# EAGLE schematic BMS_High_Level_4_17_19 (EAGLE 9.3.1)

## Sheet 1 of 3: High Level
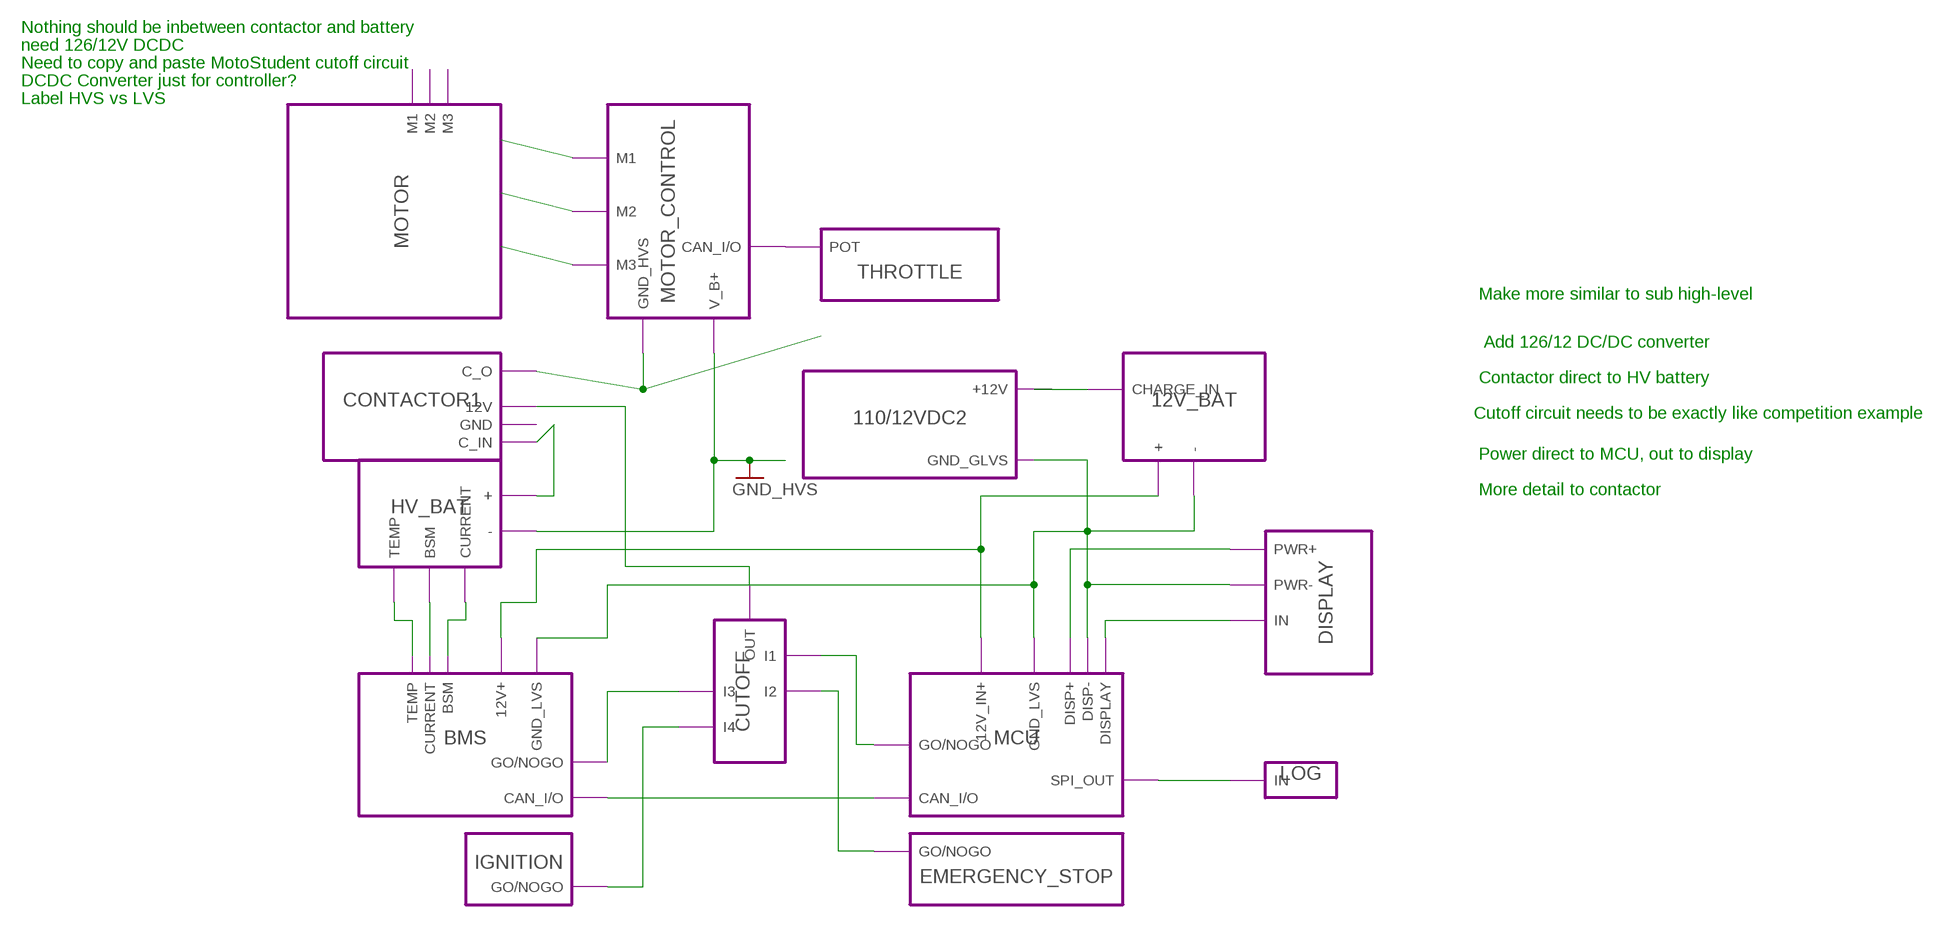
[diagram p0: schematic, sheet 1]

### Module instances
BMS = MODULE
CONTACTOR1 = CONTACTOR
MOTOR_CONTROL = MOTOR/MOTOR_CONTROL
CUTOFF = CUTOFF
MCU = MCU
EMERGENCY_STOP = EMERGENCY_STOP
THROTTLE = THROTTLE
IGNITION = IGNITION
DISPLAY = DISPLAY
LOG = LOG
MOTOR = MOTOR
HV_BAT = HV_BAT
12V_BAT = 12V_BAT
110/12VDC2 = 110/12VDC

### Nets
GND_BMS: port MOTOR_CONTROL.V_B+ 110/12VDC2.GND_GLVS HV_BAT.- ; supply symbol labelled GND_HVS
N$5: port 12V_BAT.CHARGE_IN
N$6: port CONTACTOR1.C_O 110/12VDC2.+12V MOTOR_CONTROL.GND_HVS
N$7: port MCU.DISPLAY DISPLAY.IN
N$8: port BMS.12V+ MCU.12V_IN+ 12V_BAT.+
N$9: port BMS.GND_LVS MCU.GND_LVS 12V_BAT.- MCU.DISP- DISPLAY.PWR-
N$10: port DISPLAY.PWR+ MCU.DISP+
N$11: port HV_BAT.+ CONTACTOR1.C_IN
N$13: port HV_BAT.BSM BMS.CURRENT
N$14: port HV_BAT.TEMP BMS.TEMP
N$15: port HV_BAT.CURRENT BMS.BSM
N$16: port IGNITION.GO/NOGO CUTOFF.I4
N$17: port BMS.GO/NOGO CUTOFF.I3
N$18: port BMS.CAN_I/O MCU.CAN_I/O
N$19: port MCU.GO/NOGO CUTOFF.I1
N$20: port EMERGENCY_STOP.GO/NOGO CUTOFF.I2
N$21: port MCU.SPI_OUT LOG.IN
N$22: port CONTACTOR1.12V CUTOFF.OUT
N$45: port THROTTLE.POT MOTOR_CONTROL.CAN_I/O
N$50: port MOTOR_CONTROL.M1 MOTOR.M1
N$51: port MOTOR_CONTROL.M2 MOTOR.M2
N$52: port MOTOR_CONTROL.M3 MOTOR.M3

### Notes on the sheet
- Nothing should be inbetween contactor and battery
- need 126/12V DCDC
- Need to copy and paste MotoStudent cutoff circuit
- DCDC Converter just for controller?
- Label HVS vs LVS
- Make more similar to sub high-level
- Add 126/12 DC/DC converter
- Contactor direct to HV battery
- Cutoff circuit needs to be exactly like competition example
- Power direct to MCU, out to display
- More detail to contactor

## Sheet 2 of 3: Sub-High Level
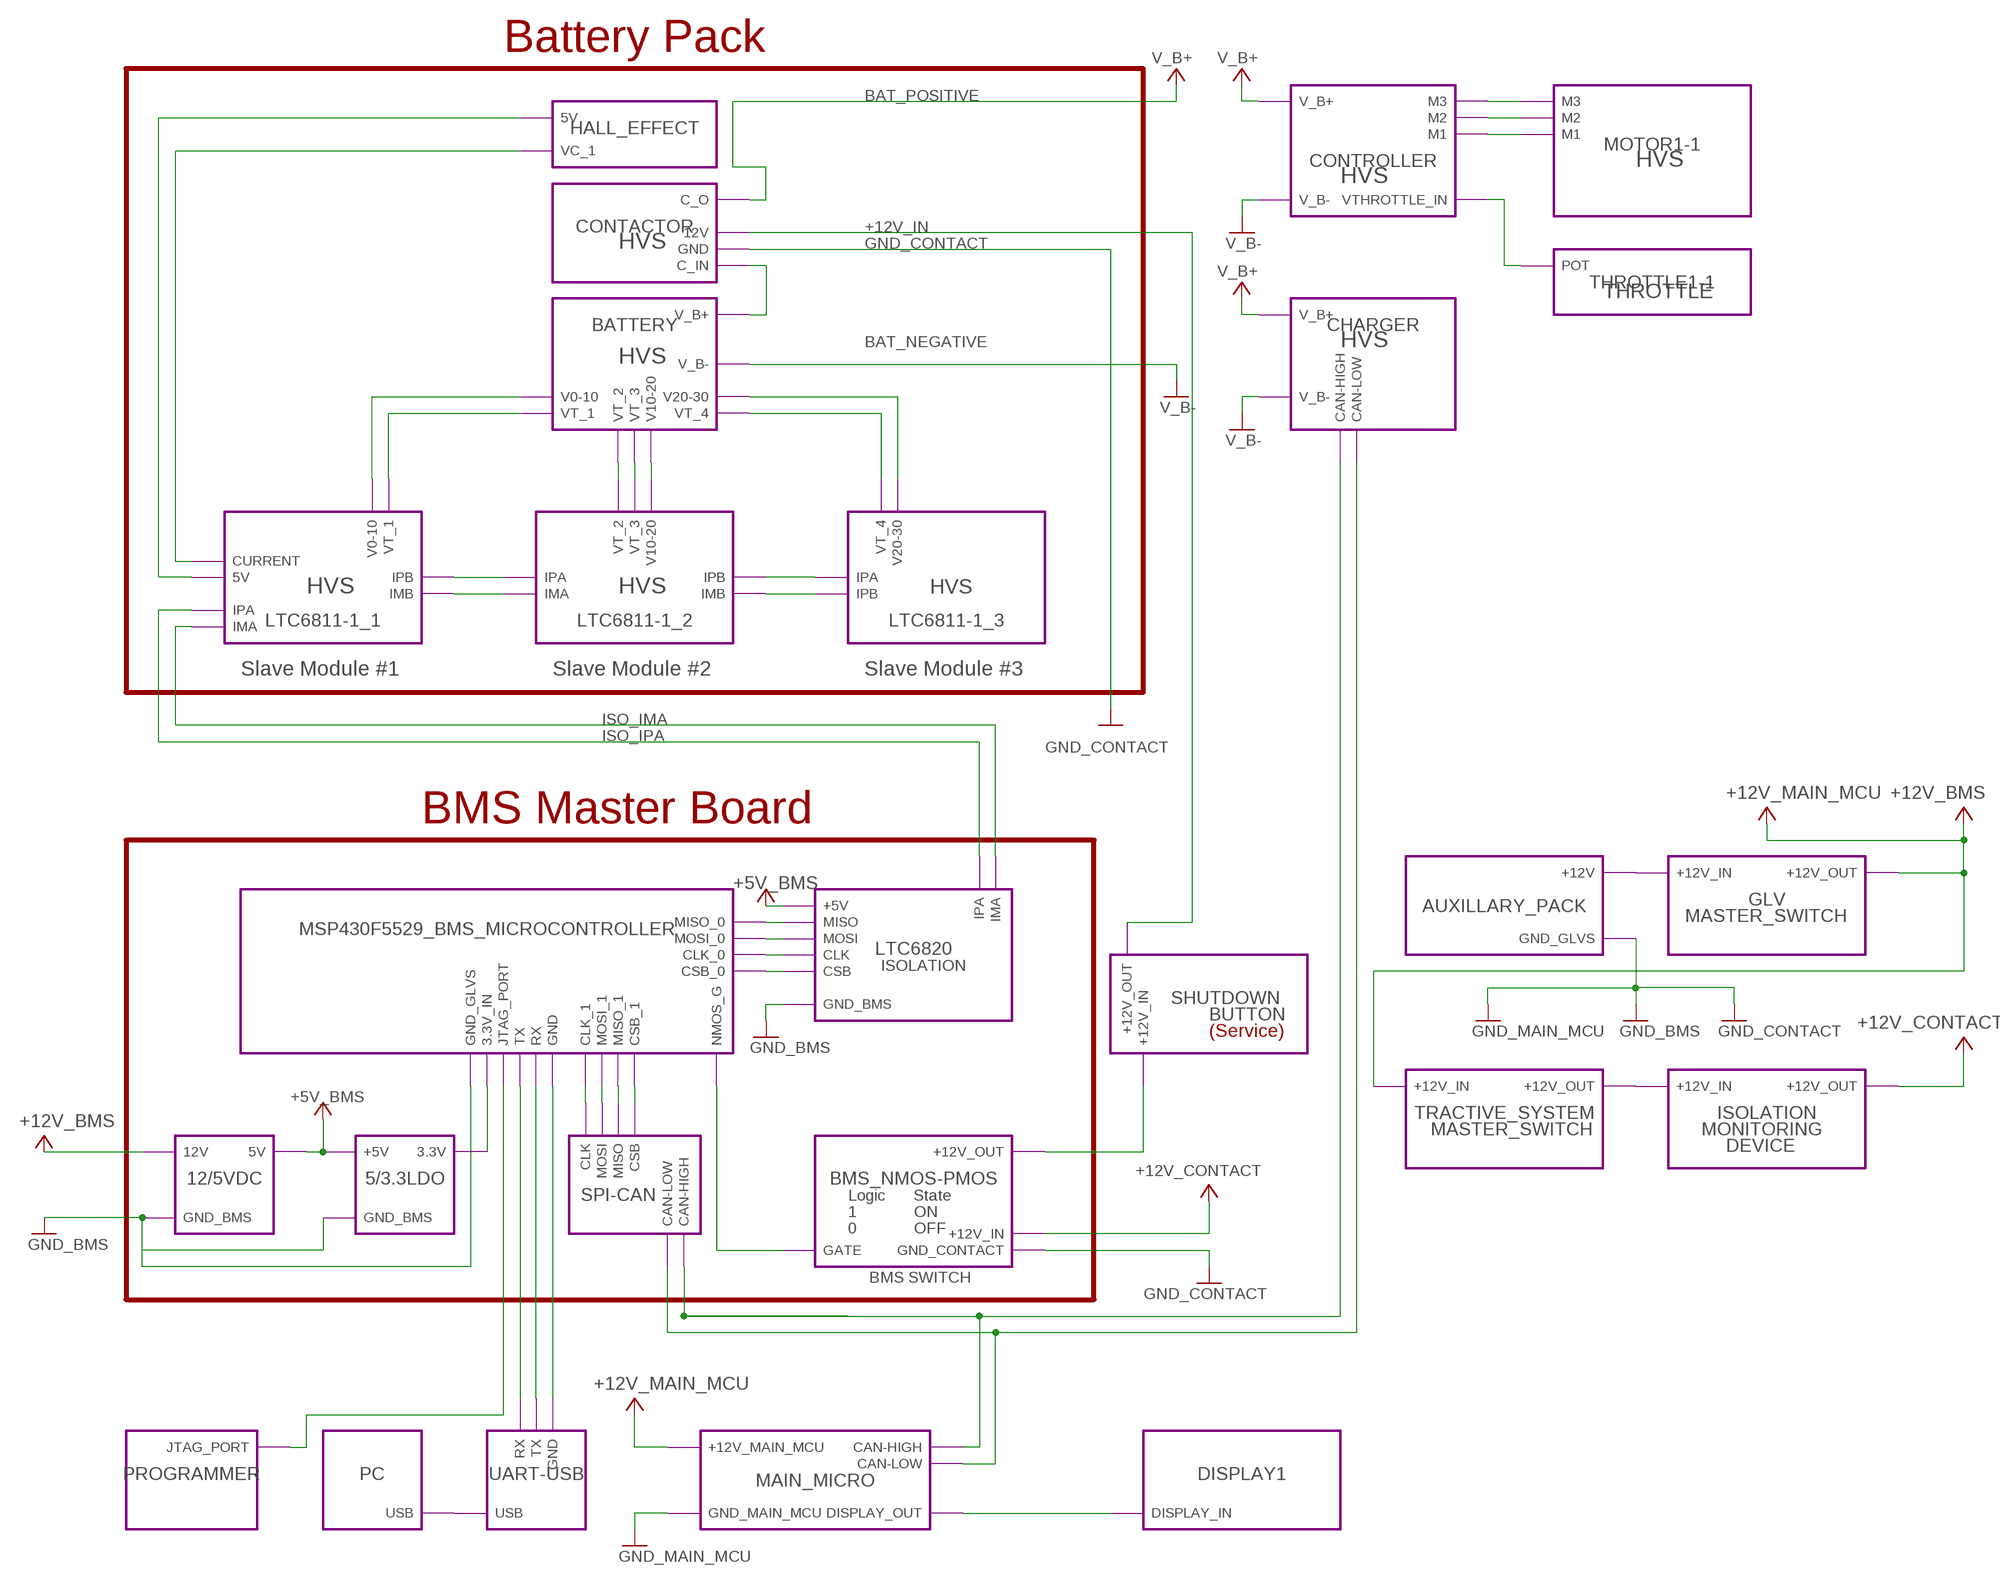
[diagram p1: schematic, sheet 2]

### Module instances
BATTERY1 = BATTERY
LTC6811-1_4 = BMS
CONTACTOR2 = CONTACTOR
AUXILLARY_PACK = 110/12VDC
12/5VDC1 = 12/5VDC$A
MSP430F5529_BMS_MICROCONTROLLER = MASTER_MICROCONTROLLER$A
MAIN_MICRO1 = ECU
HALL_EFFECT = AMMETER$A
BMS_NMOS-PMOS = SWITCH
SHUTDOWN = CUTOF_CIRCUIT
CONTROLLER1 = CONTROLLER
LTC6811-1_5 = BMS_2
CHARGER1 = CHARGER
LTC1 = SIGNAL_ISOLATOR
PC1 = PC
UART-USB1 = UART-USB
SPI-CAN1 = SPI-CAN$A
LTC6811-1_6 = BMS_3
5/3.3LDO = 12/3.3VDC
PROGRAMMER = PROGRAMMER
GLV = GLV_MASTER_SWITCH
TRACTIVE_SYSTEM = GLV_MASTER_SWITCH
ISOLATION = GLV_MASTER_SWITCH
MOTOR1-1 = MOTOR1
THROTTLE1-1 = THROTTLE1
DISPLAY1 = DISPLAY1

### Nets
+5V_BMS: port LTC1.+5V 5/3.3LDO.+5V 12/5VDC1.5V ; supply symbol labelled +12V_GLVS
+12V: port GLV.+12V_OUT TRACTIVE_SYSTEM.+12V_IN ; supply symbol labelled +12V_MAIN_MCU, +12V_BMS
+12V_IN: port CONTACTOR2.12V
BAT_NEGATIVE: port BATTERY1.V_B- ; supply symbol labelled V_B-
BAT_POSITIVE: port CONTACTOR2.C_O ; supply symbol labelled V_B+
CAN_LOW_CHARGER: port SPI-CAN1.CAN-LOW CHARGER1.CAN-LOW MAIN_MICRO1.CAN-LOW
GND: port AUXILLARY_PACK.GND_GLVS 12/5VDC1.GND_BMS 5/3.3LDO.GND_BMS MSP430F5529_BMS_MICROCONTROLLER.GND_GLVS BMS_NMOS-PMOS.GND_CONTACT MAIN_MICRO1.GND_MAIN_MCU LTC1.GND_BMS ; supply symbol labelled GND_MAIN_MCU, GND_CONTACT, GND_BMS
GND_CONTACT: port CONTACTOR2.GND
ISO_IMA: port LTC1.IMA LTC6811-1_4.IMA
ISO_IPA: port LTC6811-1_4.IPA LTC1.IPA
N$1: port CHARGER1.V_B- ; supply symbol labelled V_B-
N$2: port LTC6811-1_4.5V HALL_EFFECT.5V
N$3: port LTC6811-1_4.VT_1 BATTERY1.VT_1
N$4: port BATTERY1.VT_2 LTC6811-1_5.VT_2
N$12: port PROGRAMMER.JTAG_PORT MSP430F5529_BMS_MICROCONTROLLER.JTAG_PORT
N$23: port CONTROLLER1.V_B- ; supply symbol labelled V_B-
N$24: port BMS_NMOS-PMOS.+12V_OUT SHUTDOWN.+12V_IN
N$25: port MAIN_MICRO1.DISPLAY_OUT DISPLAY1.DISPLAY_IN
N$26: port CONTROLLER1.V_B+ ; supply symbol labelled V_B+
N$27: port HALL_EFFECT.VC_1 LTC6811-1_4.CURRENT
N$29: port MSP430F5529_BMS_MICROCONTROLLER.3.3V_IN 5/3.3LDO.3.3V
N$30: port SPI-CAN1.CAN-HIGH CHARGER1.CAN-HIGH MAIN_MICRO1.CAN-HIGH
N$31: port SPI-CAN1.CLK MSP430F5529_BMS_MICROCONTROLLER.CLK_1
N$33: port GLV.+12V_IN AUXILLARY_PACK.+12V
N$34: port MSP430F5529_BMS_MICROCONTROLLER.MISO_0 LTC1.MISO
N$35: port MSP430F5529_BMS_MICROCONTROLLER.MOSI_0 LTC1.MOSI
N$36: port MSP430F5529_BMS_MICROCONTROLLER.CLK_0 LTC1.CLK
N$37: port MSP430F5529_BMS_MICROCONTROLLER.NMOS_G BMS_NMOS-PMOS.GATE
N$38: port MSP430F5529_BMS_MICROCONTROLLER.CSB_0 LTC1.CSB
N$40: port TRACTIVE_SYSTEM.+12V_OUT ISOLATION.+12V_IN
N$41: port LTC6811-1_4.IPB LTC6811-1_5.IPA
N$42: port LTC6811-1_4.IMB LTC6811-1_5.IMA
N$43: port LTC6811-1_6.VT_4 BATTERY1.VT_4
N$44: port LTC6811-1_5.VT_3 BATTERY1.VT_3
N$46: port BATTERY1.V10-20 LTC6811-1_5.V10-20
N$47: port LTC6811-1_6.IPA LTC6811-1_5.IPB
N$48: port LTC6811-1_5.IMB LTC6811-1_6.IPB
N$53: port CONTROLLER1.M3 MOTOR1-1.M3
N$54: port CONTROLLER1.M2 MOTOR1-1.M2
N$55: port CONTROLLER1.M1 MOTOR1-1.M1
N$61: port MSP430F5529_BMS_MICROCONTROLLER.TX UART-USB1.RX
N$62: port MSP430F5529_BMS_MICROCONTROLLER.RX UART-USB1.TX
N$63: port MSP430F5529_BMS_MICROCONTROLLER.GND UART-USB1.GND
N$70: port BATTERY1.V_B+ CONTACTOR2.C_IN
N$72: port PC1.USB UART-USB1.USB
N$74: port MSP430F5529_BMS_MICROCONTROLLER.CSB_1 SPI-CAN1.CSB
N$88: port SPI-CAN1.MOSI MSP430F5529_BMS_MICROCONTROLLER.MOSI_1
N$89: port MSP430F5529_BMS_MICROCONTROLLER.MISO_1 SPI-CAN1.MISO
THROTTLE: port CONTROLLER1.VTHROTTLE_IN THROTTLE1-1.POT
V0-10: port LTC6811-1_4.V0-10 BATTERY1.V0-10
V20-30: port BATTERY1.V20-30 LTC6811-1_6.V20-30
V+: port ISOLATION.+12V_OUT 12/5VDC1.12V BMS_NMOS-PMOS.+12V_IN MAIN_MICRO1.+12V_MAIN_MCU ; supply symbol labelled +12V_CONTACT, +12V_BMS, +12V_MAIN_MCU
VCC: port CHARGER1.V_B+ ; supply symbol labelled V_B+

### Notes on the sheet
- Battery Pack
- HVS
- HVS
- HVS
- HVS
- HVS
- HVS | HVS | HVS
- Slave Module #1 | Slave Module #2 | Slave Module #3
- BMS Master Board
- MASTER_SWITCH
- ISOLATION
- BUTTON
- (Service)
- MASTER_SWITCH | MONITORING
- DEVICE
- Logic | State
- 1 | ON
- 0 | OFF
- BMS SWITCH

## Sheet 3 of 3

## Library data of the parts

## Module BATTERY
Ports: V_B-(pwr) V_B+(pwr) V0-10(out) V10-20(out) V20-30(out) VT_1(out) VT_2(out) VT_3(out) VT_4(out)

### Library data of the parts

## Module CONTACTOR
Ports: C_IN(in) C_O(out) 12V(in) GND(pwr)

### Library data of the parts

## Module 110/12VDC
Ports: GND_GLVS(pwr) +12V(pwr)

### Library data of the parts

## Module 12/5VDC
Ports: 12V(pwr) GND_LVS(pwr) 5V(pwr) GND_5V(oc)

### Library data of the parts

## Module MASTER_MICROCONTROLLER
Ports: V_G(in) V_T(in) V_5V(in) V_HALL(in) CTL_HALL(in) GND_5V(oc) 5V_IN(pwr) TX(out) RX(in) GND(pwr) CONTACT(out) CLK_1(out) MOSI_1(out) MISO_1(in) CSB_1(out) CLK_0(out) MOSI_0(out) MISO_0(in) CSB_0(out)

### Library data of the parts

## Module TEMP
Ports: VT_3(out) VT_2(out) VT_1(out) VT_4(out)

### Library data of the parts

## Module AMMETER
Ports: C_O(out) C_V-(out) C_V+(out) C_IN(in)

### Library data of the parts

## Module PC
Ports: USB(io)

### Library data of the parts

## Module ECU
Ports: CAN-HIGH(in) CAN-LOW(in) +12V_MAIN_MCU(pwr) GND_MAIN_MCU(pwr) DISPLAY_OUT(pwr)

### Library data of the parts

## Module SWITCH
Ports: GATE(in) +12V_IN(pwr) +12V_OUT(pwr) GND_CONTACT(pwr)

### Library data of the parts

## Module CUTOF_CIRCUIT
Ports: +12V_IN(pwr) +12V_OUT(out)

### Library data of the parts

## Module CONTROLLER
Ports: V_B-(pwr) V_B+(pwr) VTHROTTLE_IN(in) M1(pwr) M2(pwr) M3(pwr)

### Library data of the parts

## Module BMS_2
Ports: V10-20(in) IPA(io) IMA(io) IPB(io) IMB(io) VT_2(in) VT_3(in)

### Library data of the parts

## Module LT8584
Ports: D_IN(in) V_IN(in) GND(in) SW(out) V_CELL(out)

### Library data of the parts

## Module COILCRAFT
Ports: SW(in) V_MOD+(out) V_MOD-(out) V_IN(in)

### Library data of the parts

## Module 16BITADC
Ports: 

### Library data of the parts

## Module MICROCONTROLLER(>=27PINS)
Ports: S1(out) C1(in) C0(in) C2(in) S2(out) S13(out) C13(in)

### Library data of the parts

## Module BMS
Ports: V0-10(in) IPA(io) IMA(io) IMB(io) IPB(io) CURRENT(in) VT_1(in) 5V(pwr)
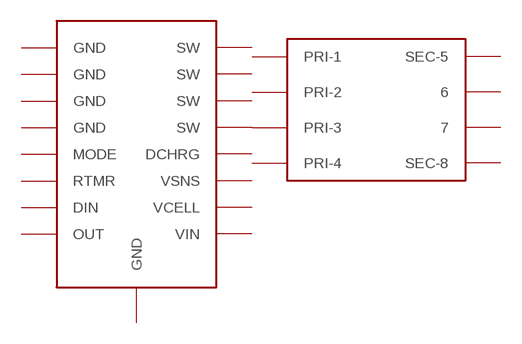
[diagram p2: schematic, module BMS, sheet 1]

### Parts
TEST  NA5743-AL  [NA5743-AL]
U$1  LT8584  [LT8584]

### Nets
N$1: TEST.3(PRI-3) U$1.13-SW(SW)
Unconnected: TEST.1(PRI-1) TEST.2(PRI-2) TEST.4(PRI-4) TEST.5(SEC-5) TEST.6 TEST.7 TEST.8(SEC-8) U$1.1-GND(GND) U$1.2-GND(GND) U$1.3-GND(GND) U$1.4-GND(GND) U$1.5-MODE(MODE) U$1.6-RTMR(RTMR) U$1.7-DIN(DIN) U$1.8-OUT(OUT) U$1.9-VIN(VIN) U$1.10-VCELL(VCELL) U$1.11-VSNS(VSNS) U$1.12-DCHRG(DCHRG) U$1.14-SW(SW) U$1.15-SW(SW) U$1.16-SW(SW) U$1.17-GND(GND)

### Library data of the parts
TEST = Library_Capstone:NA5743-AL
U$1 = Library_Capstone:LT8584

## Module GLVMS
Ports: OUT(out) IN(in)

### Library data of the parts

## Module CHARGER
Ports: CAN-LOW(in) CAN-HIGH(in) V_B+(pwr) V_B-(pwr)

### Library data of the parts

## Module SIGNAL_ISOLATOR
Ports: IPA(io) IMA(io) CLK(in) MOSI(in) MISO(out) CSB(in) +5V(pwr) GND_BMS(pwr)

### Library data of the parts

## Module HIGH_LEVEL
Ports: 

### Library data of the parts

## Module SUB_HIGH_LEVEL
Ports: 

### Library data of the parts

## Module UART-USB
Ports: RX(in) TX(out) GND(pwr) USB(io)

### Library data of the parts

## Module SPI-CAN
Ports: CLK(in) MOSI(in) CSB(in) MISO(out) CAN-LOW(out) CAN-HIGH(out)

### Library data of the parts

## Module BMS_3
Ports: V20-30(in) VT_4(in) IPA(io) IPB(io)

### Library data of the parts

## Module TEST
Ports: CLK(out) MOSI(out)

### Library data of the parts

## Module MODULE
Ports: CAN_I/O(io) GO/NOGO(out) 12V+(pwr) GND_LVS(pwr) CURRENT(io) BSM(io) TEMP(io)

### Library data of the parts

## Module MOTOR_DC/DC
Ports: V_B+(pwr) V_B-(pwr) 80V(pwr) 0V(pwr)

### Library data of the parts

## Module MOTOR/MOTOR_CONTROL
Ports: V_B+(pwr) GND_HVS(pwr) CAN_I/O(io) M1(pwr) M2(pwr) M3(pwr)

### Library data of the parts

## Module CUTOFF
Ports: OUT(out) I1(in) I2(in) I4(in) I3(in)

### Library data of the parts

## Module MCU
Ports: CAN_I/O(io) GO/NOGO(out) 12V_IN+(pwr) GND_LVS(pwr) DISPLAY(out) SPI_OUT(out) DISP+(pwr) DISP-(pwr)

### Library data of the parts

## Module EMERGENCY_STOP
Ports: GO/NOGO(out)

### Library data of the parts

## Module THROTTLE
Ports: POT(io)

### Library data of the parts

## Module IGNITION
Ports: GO/NOGO(out)

### Library data of the parts

## Module DISPLAY
Ports: IN(in) PWR+(pwr) PWR-(pwr)

### Library data of the parts

## Module LOG
Ports: IN(in)

### Library data of the parts

## Module MOTOR
Ports: M1(pwr) M2(pwr) M3(pwr)

### Library data of the parts

## Module HV_BAT
Ports: TEMP(io) BSM(io) CURRENT(io) +(pwr) -(pwr)

### Library data of the parts

## Module 12V_BAT
Ports: +(pwr) -(pwr) CHARGE_IN(pwr)

### Library data of the parts

## Module 12/5VDC$A
Ports: 12V(pwr) GND_BMS(pwr) 5V(pwr)

### Library data of the parts

## Module MASTER_MICROCONTROLLER$A
Ports: GND_GLVS(oc) 3.3V_IN(pwr) TX(out) RX(in) GND(pwr) NMOS_G(out) CLK_1(out) MOSI_1(out) MISO_1(in) CSB_1(out) CLK_0(out) MOSI_0(out) MISO_0(in) CSB_0(out) JTAG_PORT(io)

### Library data of the parts

## Module AMMETER$A
Ports: VC_1(out) 5V(pwr)

### Library data of the parts

## Module SPI-CAN$A
Ports: CLK(in) MOSI(in) CSB(in) MISO(out) CAN-LOW(out) CAN-HIGH(out)

### Library data of the parts

## Module 12/3.3VDC
Ports: +5V(pwr) 3.3V(pwr) GND_BMS(pwr)

### Library data of the parts

## Module PROGRAMMER
Ports: JTAG_PORT(io)

### Library data of the parts

## Module GLV_MASTER_SWITCH
Ports: +12V_IN(pwr) +12V_OUT(pwr)

### Library data of the parts

## Module MOTOR1
Ports: M3(pwr) M2(pwr) M1(pwr)

### Library data of the parts

## Module THROTTLE1
Ports: POT(pwr)

### Library data of the parts

## Module DISPLAY1
Ports: DISPLAY_IN(pwr)

### Library data of the parts

## Net classes
1 HVS: width 0.762 mm, clearance 0.127 mm